# Altium schematic sheet 03_POWER.SchDoc: =GlobalProjectName
size 594 x 420 mm; CheckedBy: A_D; Author: A_D; SheetNumber: 3; SheetTotal: 3; PageSetup: Record=PageOptions|CenterHorizontal=True|CenterVertical=True|PrintScale=0.70|XCorrection=1.00|YCorrection=1.00|PrintKind=2|BorderSize=5000000|LeftOffset=9000|BottomOffset=10100|Orientation=2|PaperLength=11176|PaperWidth=8636|Scale=100|PaperSource=259|PrintQuality=-3|MediaType=1|DitherType=10|PrintScaleMode=1|PaperKind=A3|PaperIndex=8
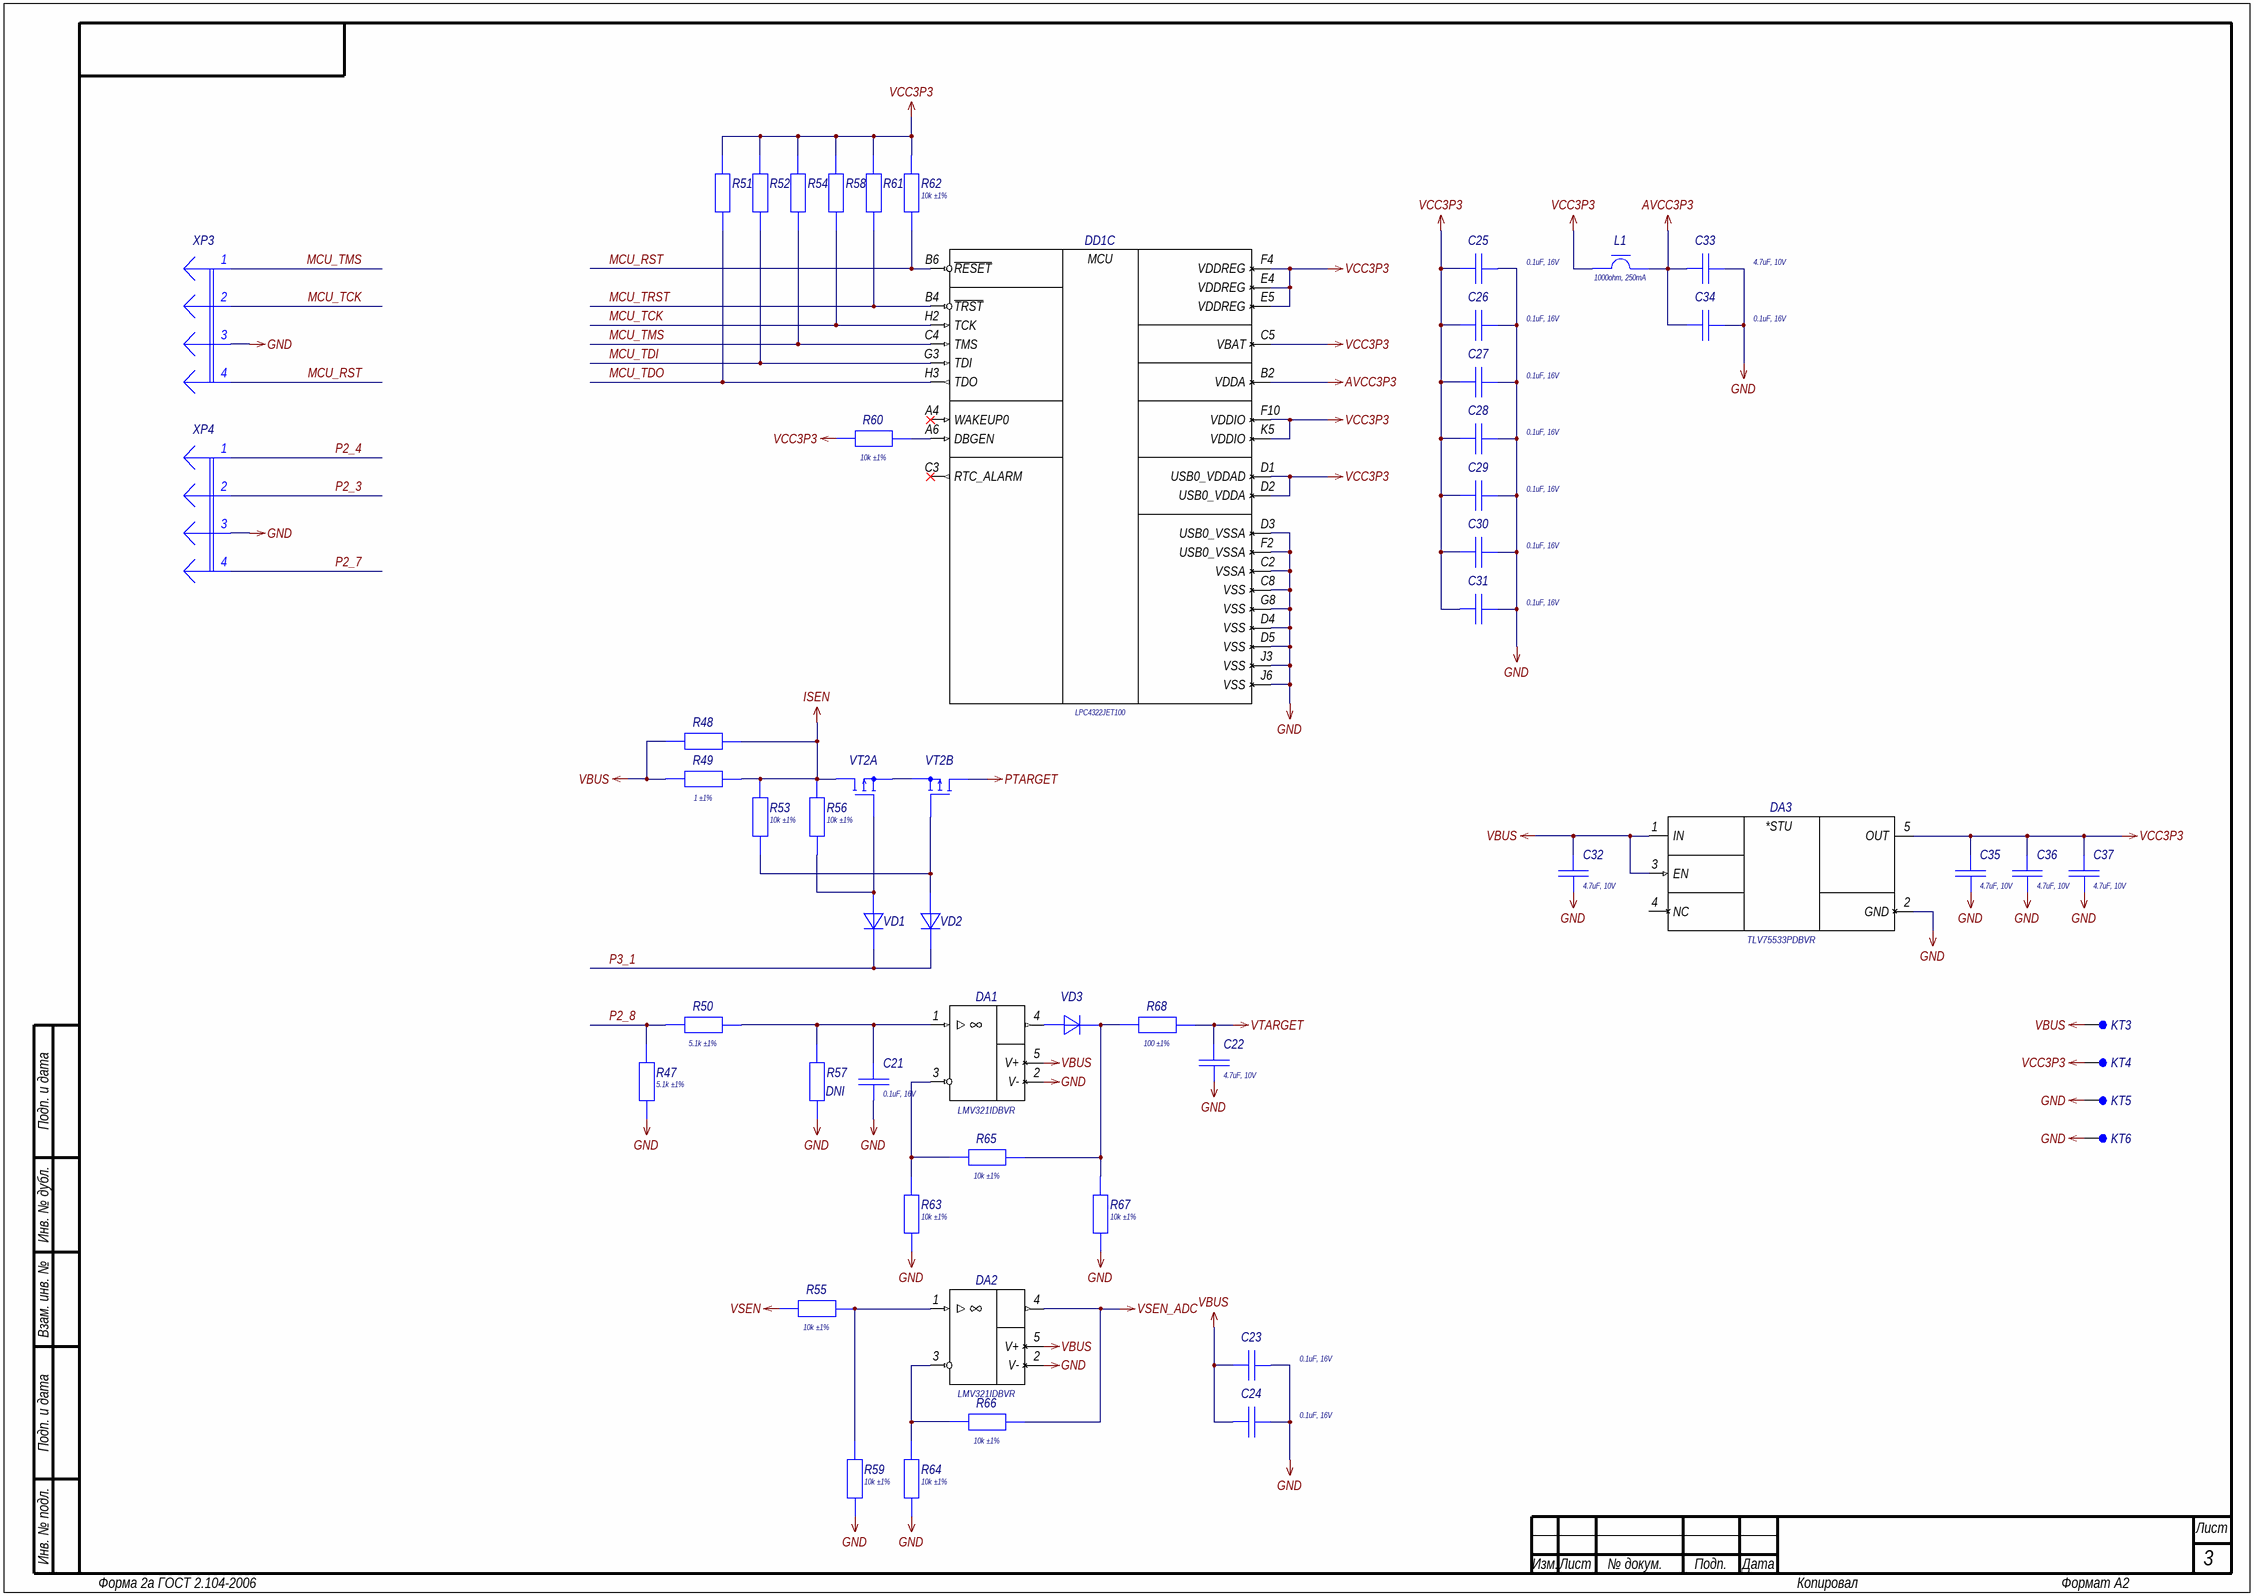
[diagram p0: 03_POWER.SchDoc]

## Parts
C21  Schematic Value: 0.1uF, 16V  [C0402_100X050H050_H]  (hidden comment: Capacitor)
C22  Schematic Value: 4.7uF, 10V  [C0402_100X050H050_H]  (hidden comment: Capacitor)
C23  Schematic Value: 0.1uF, 16V  [C0402_100X050H050_H]  (hidden comment: Capacitor)
C24  Schematic Value: 0.1uF, 16V  [C0402_100X050H050_H]  (hidden comment: Capacitor)
C25  Schematic Value: 0.1uF, 16V  [C0402_100X050H050_H]  (hidden comment: Capacitor)
C26  Schematic Value: 0.1uF, 16V  [C0402_100X050H050_H]  (hidden comment: Capacitor)
C27  Schematic Value: 0.1uF, 16V  [C0402_100X050H050_H]  (hidden comment: Capacitor)
C28  Schematic Value: 0.1uF, 16V  [C0402_100X050H050_H]  (hidden comment: Capacitor)
C29  Schematic Value: 0.1uF, 16V  [C0402_100X050H050_H]  (hidden comment: Capacitor)
C30  Schematic Value: 0.1uF, 16V  [C0402_100X050H050_H]  (hidden comment: Capacitor)
C31  Schematic Value: 0.1uF, 16V  [C0402_100X050H050_H]  (hidden comment: Capacitor)
C32  Schematic Value: 4.7uF, 10V  [C0402_100X050H050_H]  (hidden comment: Capacitor)
C33  Schematic Value: 4.7uF, 10V  [C0402_100X050H050_H]  (hidden comment: Capacitor)
C34  Schematic Value: 0.1uF, 16V  [C0402_100X050H050_H]  (hidden comment: Capacitor)
C35  Schematic Value: 4.7uF, 10V  [C0402_100X050H050_H]  (hidden comment: Capacitor)
C36  Schematic Value: 4.7uF, 10V  [C0402_100X050H050_H]  (hidden comment: Capacitor)
C37  Schematic Value: 4.7uF, 10V  [C0402_100X050H050_H]  (hidden comment: Capacitor)
DA1  Schematic Value: LMV321IDBVR  [SOT-23-5_095P290X160X145_N]  (hidden comment: OPA-1-5p_2)
DA2  Schematic Value: LMV321IDBVR  [SOT-23-5_095P290X160X145_N]  (hidden comment: OPA-1-5p_2)
DA3  Schematic Value: TLV75533PDBVR  [SOT-23-5_095P290X160X145_N]  (hidden comment: TLV755xxPDBV-Series)
DD1  Schematic Value: LPC4322JET100  [TFBGA-100_080P900X900X120_N]  (hidden comment: LPC43xxJET100-Series)  (part C of 3)
KT3  Text  [TP-SMT-C-1mm]  (value not drawn)  (no BOM)
KT4  Text  [TP-SMT-C-1mm]  (value not drawn)  (no BOM)
KT5  Text  [TP-SMT-R-1.0mm]  (value not drawn)  (no BOM)
KT6  Text  [TP-SMT-R-1.0mm]  (value not drawn)  (no BOM)
L1  Schematic Value: 1000ohm, 250mA  [L0402_100X050H050_H]  (hidden comment: FerriteBead)
R47  Schematic Value: 5.1k ±1%  [R0402_100X050H035_H]  (hidden comment: Resistor)
R48  Resistor  [R0402_100X050H035_H]  (value not drawn)
R49  Schematic Value: 1 ±1%  [R0402_100X050H035_H]  (hidden comment: Resistor)
R50  Schematic Value: 5.1k ±1%  [R0402_100X050H035_H]  (hidden comment: Resistor)
R51  Resistor  [R0402_100X050H035_H]  (value not drawn)
R52  Resistor  [R0402_100X050H035_H]  (value not drawn)
R53  Schematic Value: 10k ±1%  [R0402_100X050H035_H]  (hidden comment: Resistor)
R54  Resistor  [R0402_100X050H035_H]  (value not drawn)
R55  Schematic Value: 10k ±1%  [R0402_100X050H035_H]  (hidden comment: Resistor)
R56  Schematic Value: 10k ±1%  [R0402_100X050H035_H]  (hidden comment: Resistor)
R57  Resistor  [R0402_100X050H035_H]  (value not drawn)  (no BOM)
R58  Resistor  [R0402_100X050H035_H]  (value not drawn)
R59  Schematic Value: 10k ±1%  [R0402_100X050H035_H]  (hidden comment: Resistor)
R60  Schematic Value: 10k ±1%  [R0402_100X050H035_H]  (hidden comment: Resistor)
R61  Resistor  [R0402_100X050H035_H]  (value not drawn)
R62  Schematic Value: 10k ±1%  [R0402_100X050H035_H]  (hidden comment: Resistor)
R63  Schematic Value: 10k ±1%  [R0402_100X050H035_H]  (hidden comment: Resistor)
R64  Schematic Value: 10k ±1%  [R0402_100X050H035_H]  (hidden comment: Resistor)
R65  Schematic Value: 10k ±1%  [R0402_100X050H035_H]  (hidden comment: Resistor)
R66  Schematic Value: 10k ±1%  [R0402_100X050H035_H]  (hidden comment: Resistor)
R67  Schematic Value: 10k ±1%  [R0402_100X050H035_H]  (hidden comment: Resistor)
R68  Schematic Value: 100 ±1%  [R0402_100X050H035_H]  (hidden comment: Resistor)
VD1  Diode  [SOD-523]  (value not drawn)
VD2  Diode  [SOD-523]  (value not drawn)
VD3  Diode  [SOD-523]  (value not drawn)
VT2  MOSFET-PP_8p_2  [SOT-1118-2M_065P200X200X065_N]  (value not drawn)  (parts A,B of 2)
XP3  Text  [PLS-4]  (value not drawn)
XP4  Text  [PLS-4]  (value not drawn)

## Nets
AVCC3P3: C33.2 C34.2 DD1.B2(VDDA) L1.2
GND: C21.1 C22.1 C23.1 C24.1 C25.1 C26.1 C27.1 C28.1 C29.1 C30.1 C31.1 C32.2 C33.1 C34.1 C35.2 C36.2 C37.2 DA1.2(V-) DA2.2(V-) DA3.2(GND) DD1.C2(VSSA) DD1.C8(VSS) DD1.D3(USB0_VSSA) DD1.D4(VSS) DD1.D5(VSS) DD1.F2(USB0_VSSA) DD1.G8(VSS) DD1.J3(VSS) DD1.J6(VSS) KT5.1 KT6.1 R47.1 R57.1 R59.2 R63.2 R64.2 R67.2 XP3.3 XP4.3
ISEN: R48.2 R49.2 R53.2 R56.2 VT2.6(D1)
PTARGET: VT2.3(D2)
VBUS: C23.2 C24.2 C32.1 DA1.5(V+) DA2.5(V+) DA3.1(IN) DA3.3(EN) KT3.1 R48.1 R49.1
VCC3P3: C25.2 C26.2 C27.2 C28.2 C29.2 C30.2 C31.2 C35.1 C36.1 C37.1 DA3.5(OUT) DD1.C5(VBAT) DD1.D1(USB0_VDDAD) DD1.D2(USB0_VDDA) DD1.E4(VDDREG) DD1.E5(VDDREG) DD1.F4(VDDREG) DD1.F10(VDDIO) DD1.K5(VDDIO) KT4.1 L1.1 R51.2 R52.2 R54.2 R58.2 R60.1 R61.2 R62.2
VSEN: R55.1
VSEN_ADC: DA2.4(OUT) R66.2
VTARGET: C22.2 R68.2
MCU_RST: DD1.B6(~{RESET}) R62.1 XP3.4
MCU_TCK: DD1.H2(TCK) R58.1 XP3.2
MCU_TDI: DD1.G3(TDI) R52.1
MCU_TDO: DD1.H3(TDO) R51.1
MCU_TMS: DD1.C4(TMS) R54.1 XP3.1
MCU_TRST: DD1.B4(~{TRST}) R61.1
P2_3: XP4.2
P2_4: XP4.1
P2_7: XP4.4
P2_8: R47.2 R50.2
P3_1: VD1.2(К) VD2.2(К)
NetC21_2: C21.2 DA1.1(IN+) R50.1 R57.2
NetDA1_3: DA1.3(IN-) R63.1 R65.1
NetDA1_4: DA1.4(OUT) VD3.1(А)
NetDA2_1: DA2.1(IN+) R55.2 R59.1
NetDA2_3: DA2.3(IN-) R64.1 R66.1
NetDD1_A6: DD1.A6(DBGEN) R60.2
NetR53_1: R53.1 VD2.1(А) VT2.5(G2)
NetR56_1: R56.1 VD1.1(А) VT2.2(G1)
NetR65_2: R65.2 R67.1 R68.1 VD3.2(К)
NetVT2_1: VT2.1(S1) VT2.4(S2)

Not connected (* = marked no-connect by the designer): DA3 4(NC); DD1 A4(WAKEUP0)* C3(RTC_ALARM)*

## Notes on the sheet
- (near R57) DNI
- Подп. и дата
- Инв. № дубл.
- Взам. инв. №
- Инв. № подл.
- Изм.
- Лист
- № докум.
- Подп.
- Дата
- Форма 2а ГОСТ 2.104-2006
- Копировал
- Формат А2
- (in symbol LPC4322JET100, part C) MCU
- (in symbol TLV75533PDBVR) *STU

## Library data of the parts
C21 C23-C31 C34 = GCM155R71C104KA55D: Manufacturer: Murata; ID: 163; Value: 0.1uF; Voltage: 16V; Tolerance: ±10%; Dielectric Type: X7R; Functional Analog: GRM155R71C104KA88D, GCM155R71C104KA55J, GCM155R71C104KA55W; AEC Standard: AEC-Q200; Part Number: GCM155R71C104KA55D; Footprint: 0402; LCSC Part: C85857; Temperature Min: -55°С; Temperature Max: +125°С; Part Type: Конденсатор
C22 C32 C33 C35-C37 = GRM155R61A475MEAAD: Manufacturer: Murata; ID: 255; Value: 4.7uF; Voltage: 10V; Tolerance: ±20%; Dielectric Type: X5R; Functional Analog: GRM155R61A475MEAAJ; AEC Standard: General; Part Number: GRM155R61A475MEAAD; Footprint: 0402; LCSC Part: C335105; Temperature Min: -55°С; Temperature Max: +85°С; Part Type: Конденсатор
  C32 C35-C37: ClassName: DC
DA1 DA2 = LMV321IDBVR: Manufacturer: Texas Instruments; ID: 46; Supply Operation: +2.7…5.5V; Supply Current: 130uA; Rail-to-Rail: +\+; Slew Rate: 1V/µs; Bandwidth: 1MHz; Published: 11.04.2014; Publisher: Andrew Danich; Type: Микросхема; Part Number: LMV321IDBVR; Value: LMV321IDBVR; Temperature Min: -40°С; Temperature Max: +125°С; LCSC Part: C7972; Part Type: Микросхема
DA3 = TLV75533PDBVR: Manufacturer: Texas Instruments; ID: 37; Value: TPS73101DBVR; Input Voltage: +1.45…5.5V; Output Current: 0.5A; Output Voltage: +3.3V; Functional Analog: TLV75533PDBVT; Published: 23.05.2020; Publisher: Andrew Danich; Type: Микросхема; Part Number: TLV75533PDBVR; LCSC Part: C404027; Temperature Min: -40°С; Temperature Max: +125°С; Part Type: Микросхема; ClassName: DC
DD1 = LPC4322JET100: Manufacturer: NXP Semiconductors; ID: 45; Supply Operation: +2.4…3.6V; Prog Interface: JTAG, SWD, USB; Operation Frequency: 204MHz; ROM: 512K; RAM: 104K; IO Lines: 49; Part Number: LPC4322JET100; Value: LPC4322JET100; Temperature Min: -40°С; Temperature Max: +105°С
KT3 KT4 = TestPoint-SMT: ID: 6; Application Type: On PCB Test Point; Published: 03.03.2015; Publisher: Andrew Danich; Part Number: TestPoint-SMT; Value: TestPoint-SMT; Schematic Value: TestPoint-SMT
KT5 KT6 = TestPoint-SMT-GND: ID: 7; Application Type: On PCB Test Point; Published: 03.03.2015; Publisher: Andrew Danich; Part Number: TestPoint-SMT-GND; Value: TestPoint-SMT; Schematic Value: TestPoint-SMT-GND
L1 = BLM15HD102SN1D: Manufacturer: Murata; ID: 7; Rated Current: 250mA; Impedance: 1000ohm; Tolerance: ±25%; DC Resistance: 1.25ohm; Inductor Type: EMIFIL; Application Category: 1; Functional Analog: BLM15HD102SN1B; Part Number: BLM15HD102SN1D; Value: BLM15HD102SN1D; Footprint: 0402; Temperature Min: -55°С; Temperature Max: +125°С; Part Type: Ферритовая бусина
R47 R50 = 0402WGF5101TCE: Manufacturer: Uniroyal Elec; ID: 667; Value: 5.1k; Limit Voltage: 50V; Tolerance: ±1%; Temperature Coefficient: 100ppm; Total Power Dissipation: 0.1W; Series Type: Thick-Film; Part Number: 0402WGF5101TCE; Footprint: 0402; Temperature Min: -55°С; Temperature Max: +155°С; Part Type: Резистор; LCSC Part: C25905
R48 = RC0402FR-071RL: Manufacturer: Yageo; ID: 658; Value: 1; Limit Voltage: 50V; Tolerance: ±1%; Temperature Coefficient: 100ppm; Total Power Dissipation: 0.1W; Series Type: Thick-Film; Schematic Value: 1 ±1%; Part Number: RC0402FR-071RL; Footprint: 0402; Temperature Min: -55°С; Temperature Max: +155°С; Part Type: Резистор
R49 = RC0402FR-071RL: Manufacturer: Yageo; ID: 658; Value: 1; Limit Voltage: 50V; Tolerance: ±1%; Temperature Coefficient: 100ppm; Total Power Dissipation: 0.1W; Series Type: Thick-Film; Part Number: RC0402FR-071RL; Footprint: 0402; Temperature Min: -55°С; Temperature Max: +155°С; Part Type: Резистор
R51 R52 R54 R58 R61 = 0402WGF1002TCE: Manufacturer: Uniroyal Elec; ID: 665; Value: 10k; Limit Voltage: 50V; Tolerance: ±1%; Temperature Coefficient: 100ppm; Total Power Dissipation: 0.1W; Series Type: Thick-Film; Schematic Value: 10k ±1%; Part Number: 0402WGF1002TCE; Footprint: 0402; Temperature Min: -55°С; Temperature Max: +155°С; Part Type: Резистор; LCSC Part: C25744
R53 R55 R56 R59 R60 R62-R67 = 0402WGF1002TCE: Manufacturer: Uniroyal Elec; ID: 665; Value: 10k; Limit Voltage: 50V; Tolerance: ±1%; Temperature Coefficient: 100ppm; Total Power Dissipation: 0.1W; Series Type: Thick-Film; Part Number: 0402WGF1002TCE; Footprint: 0402; Temperature Min: -55°С; Temperature Max: +155°С; Part Type: Резистор; LCSC Part: C25744
R57 = 0402WGF5101TCE: Manufacturer: Uniroyal Elec; ID: 667; Value: 5.1k; Limit Voltage: 50V; Tolerance: ±1%; Temperature Coefficient: 100ppm; Total Power Dissipation: 0.1W; Series Type: Thick-Film; Schematic Value: 5.1k ±1%; Part Number: 0402WGF5101TCE; Footprint: 0402; Temperature Min: -55°С; Temperature Max: +155°С; Part Type: Резистор; LCSC Part: C25905
R68 = RC0402FR-07100RL: Manufacturer: Yageo; ID: 457; Value: 100; Limit Voltage: 50V; Tolerance: ±1%; Temperature Coefficient: 100ppm; Total Power Dissipation: 0.1W; Series Type: Thick-Film; Part Number: RC0402FR-07100RL; Footprint: 0402; Temperature Min: -55°С; Temperature Max: +155°С; Part Type: Резистор
VD1-VD3 = 1N4148WT-7: Manufacturer: Diodes Incorporated; ID: 18; Reverse Voltage: 100V; Reverse Current: 1uA; Forward Voltage: 1.25V; Forward Current: 250mA; Total Power Dissipation: 200mW; Capacitance: 2pF; Recovery Time: 4nS; Functional Analog: 1N4148X-TP; Part Number: 1N4148WT-7; Value: 1N4148WT-7; LCSC Part: C83482; Temperature Min: -65°С; Temperature Max: +150°С; Schematic Value: 1N4148WT-7
VT2 = PMDPB55XP,115: Manufacturer: NXP Semiconductors; Type: Сборка транзисторная; ID: 22; D-S Voltage: -20V; Drain Current: -4.5A; D-S On-Resistance: 70momh; Gate Capacitance: 785pF; Total Power Dissipation: 1.17W; Gate Threshold Voltage: -0.9V; Published: 18.07.2014; Publisher: Andrew Danich; Schematic Value: PMDPB55XP,115; Part Number: PMDPB55XP,115; Value: PMDPB55XP,115; LCSC Part: C552752; Temperature Min: -55°С; Temperature Max: +150°С; Part Type: Транзисторная сборка
XP3 XP4 = PLS-4: ID: 3; Value: PLS-4; Limit Voltage: 250V; Limit Current: 3A; Connector Type: Male; Resistance: 15momh; Surface Finish: Gold; Pitch: 2.54mm; Part Number: PLS-4; Pins: 4; Schematic Value: PLS-4